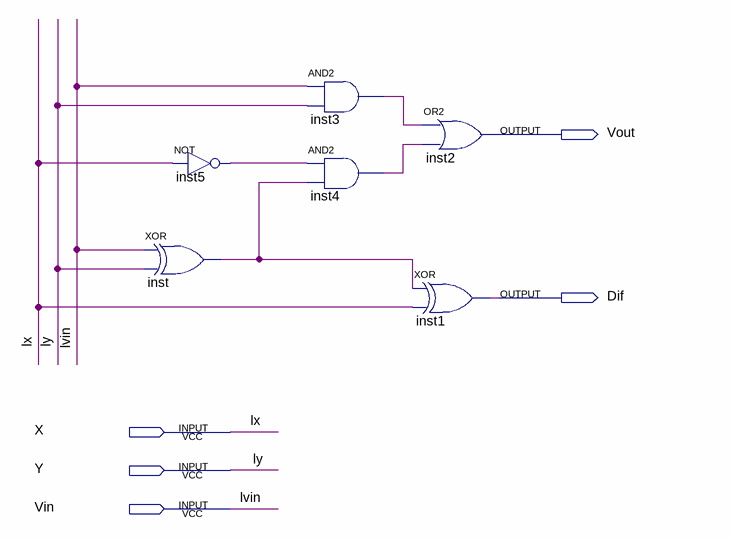
[diagram p0: schematic sheet]
// Quartus schematic FS.bdf as structural Verilog: 6 symbols, 5 pins
module FS (
  input  X,
  input  Y,
  input  Vin,
  output Vout,
  output Dif
);

  wire inst3_out, inst4_out, inst5_out, inst_out;

  xor inst (inst_out, Vin, Y);
  not inst5 (inst5_out, X);
  and inst3 (inst3_out, Vin, Y);
  and inst4 (inst4_out, inst5_out, inst_out);
  or inst2 (Vout, inst3_out, inst4_out);
  xor inst1 (Dif, inst_out, X);

  // Other names for the same wires on the sheet: lvin = Vin; lx = X; ly = Y
endmodule
